# EAGLE design VM-MCU_v5.3 (EAGLE 9.6.2)

## Sheet 1 of 2: MAINBOARD UNIT
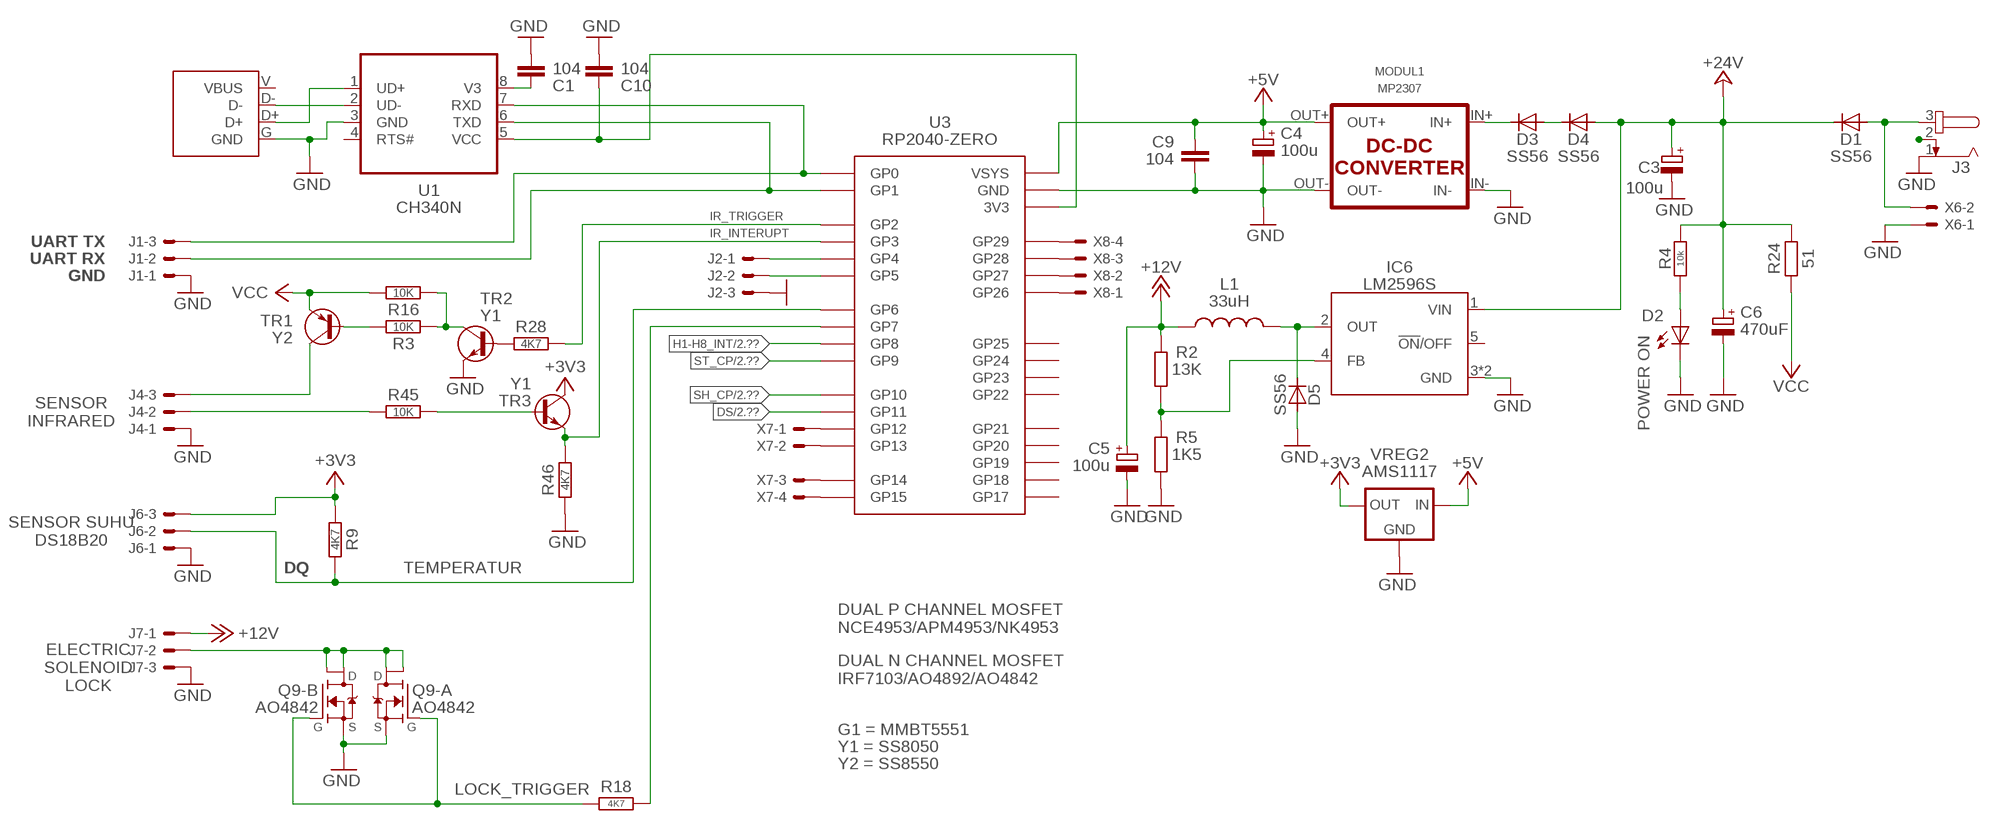
[diagram p0: schematic, sheet 1]

### Parts
C1  104  CAP_SMD-C1206  [C1206]
C3  100u  ELCO_UD-6,3X7,7  [UD-6,3X7,7_NICHICON]
C4  100u  ELCO_UD-6,3X7,7  [UD-6,3X7,7_NICHICON]
C5  100u  ELCO_UD-6,3X7,7  [UD-6,3X7,7_NICHICON]
C6  470uF  ELCO_E5-10.5  [E5-10,5]
C9  104  CAP_SMD-C1206  [C1206]
C10  104  CAP_SMD-C1206  [C1206]
D1  SS56  DIODE_DO214AC  [DO214AC]
D2  POWER ON  LED2835  [LED2835]
D3  SS56  DIODE_DO214AC  [DO214AC]
D4  SS56  DIODE_DO214AC  [DO214AC]
D5  SS56  DIODE_DO214AC  [DO214AC]
IC6  LM2596S  [TO263-5]
J1  SOKET-3P_KF2510-2.54  [KF2510-3P]
J2  SOKET-3P_JST-XH-2.54  [3P-JST-XH]
J3  JACK-DC_5.5X2.1MM  [DC-5.5X2.1]
J4  SOKET-3P_MOLEX-3.96  [3P-MOLEX]
J6  SOKET-3P_KF2510-2.54  [KF2510-3P]
J7  SOKET-3P_KF2510-2.54  [KF2510-3P]
L1  33uH  INDUKTOR10X10  [CDRH104]
MODUL1  MP2307  MINI360-MP2307MP2307-PTH  [MP2307]
Q9  AO4842  DUALFET-N_AO4892N+N  [SO-8]
R2  13K  RESISTOR_1206  [R1206]
R3  10K  RESISTOR_1206  [R1206]
R4  10k  RESISTOR_1206  [R1206]
R5  1K5  RESISTOR_1206  [R1206]
R9  4K7  RESISTOR_1206  [R1206]
R16  10K  RESISTOR_1206  [R1206]
R18  4K7  RESISTOR_1206  [R1206]
R24  51  RESISTOR_2512  [R2512]
R28  4K7  RESISTOR_1206  [R1206]
R45  10K  RESISTOR_1206  [R1206]
R46  4K7  RESISTOR_1206  [R1206]
TR1  Y2  BJT-PNP_SOT23-BCE  [SOT23-BEC]
TR2  Y1  BJT-NPN_SOT23-BEC  [SOT23-BEC]
TR3  Y1  BJT-NPN_SOT23-BEC  [SOT23-BEC]
U1  CH340N  [SO-8]
U3  RP2040-ZERO  RASPBERRY-PICO-ZERO_  [PICO-ZERO]
U$3  USB-C_BREAKOUT_  [USB-C_4P]
VREG2  AMS1117  78XXX_SOT223  [SOT223]
X6  SOKET-2P_MOLEX-3.96  [2P-MOLEX]
X7  SOKET-4P_JST-XH-2.54  [4P-JST-XH]
X8  SOKET-4P_JST-XH-2.54  [4P-JST-XH]

### Nets
+3V3: J6.3 R9.1 TR3.C VREG2.4(OUT) ; also sheet 2
+5V: C4.+ C9.1 MODUL1.OUT+ U3.5V(VSYS) VREG2.3(IN) ; also sheet 2
+12V: C5.+ J7.1 L1.1 R2.1
+24V: C3.+ C6.+ D1.C D4.A IC6.1(VIN) R4.2 R24.2 ; also sheet 2
DS: U3.P11(GP11) ; also sheet 2
GND: C1.2 C3.- C4.- C5.- C6.- C9.2 C10.2 D2.C D5.A IC6.3(GND) IC6.6(GND) J1.1 J2.3 J3.1 J4.1 J6.1 J7.3 MODUL1.IN- MODUL1.OUT- Q9.1(-A:S) Q9.3(-B:S) R5.2 R46.1 TR2.E U1.3(GND) U3.G(GND) U$3.G(GND) VREG2.1(GND) X6.1 ; also sheet 2
H1-H8_INT: U3.P8(GP8) ; also sheet 2
N$1: J1.3 U1.7(RXD) U3.P0(GP0)
N$2: J1.2 U1.6(TXD) U3.P1(GP1)
N$3: D1.A J3.3 X6.2
N$4: D2.A R4.1
N$5: J2.1 U3.P4(GP4)
N$6: R3.2 R16.2 TR2.C
N$7: R3.1 TR1.B
N$8: J2.2 U3.P5(GP5)
N$11: C10.1 U1.5(VCC) U3.3V3
N$23: J4.3 TR1.C
N$33: Q9.2(-A:G) Q9.4(-B:G) R18.2
N$34: C1.1 U1.8(V3)
N$36: U1.2(UD-) U$3.D-
N$43: J3.2
N$45: U1.1(UD+) U$3.D+
N$60: J7.2 Q9.5(-B:D1) Q9.6(-B:D2) Q9.7(-A:D2) Q9.8(-A:D1)
N$61: D3.C MODUL1.IN+
N$62: D3.A D4.C
N$64: U3.P12(GP12) X7.1
N$65: U3.P13(GP13) X7.2
N$66: U3.P14(GP14) X7.3
N$67: U3.P15(GP15) X7.4
N$68: D5.C IC6.2(OUT) L1.2
N$69: U3.P26(GP26) X8.1
N$70: U3.P27(GP27) X8.2
N$71: IC6.4(FB) R2.2 R5.1
N$72: U3.P28(GP28) X8.3
N$73: R28.1 TR2.B
N$74: R45.1 TR3.B
N$75: U3.P29(GP29) X8.4
N$86: J4.2 R45.2
P2: R28.2 U3.P2(GP2)
P3: R46.2 TR3.E U3.P3(GP3)
P6: J6.2 R9.2 U3.P6(GP6)
P7: R18.1 U3.P7(GP7)
SH_CP: U3.P10(GP10) ; also sheet 2
ST_CP: U3.P9(GP9) ; also sheet 2
VCC: R16.1 R24.1 TR1.E
Unconnected: IC6.5(!ON!/OFF) U1.4(RTS#) U3.P17(GP17) U3.P18(GP18) U3.P19(GP19) U3.P20(GP20) U3.P21(GP21) U3.P22(GP22) U3.P23(GP23) U3.P24(GP24) U3.P25(GP25) U$3.V(VBUS)

### Notes on the sheet
- IR_TRIGGER
- IR_INTERUPT
- UART TX
- UART RX
- GND
- SENSOR
  INFRARED
- SENSOR SUHU
  DS18B20
- DQ | TEMPERATUR
- DUAL P CHANNEL MOSFET
  NCE4953/APM4953/NK4953
- ELECTRIC
  SOLENOID
  LOCK
- DUAL N CHANNEL MOSFET
  IRF7103/AO4892/AO4842
- G1 = MMBT5551
- Y1 = SS8050
- Y2 = SS8550
- LOCK_TRIGGER

## Sheet 2 of 2: SHIFT REGISTER & MOSFET DRIVER
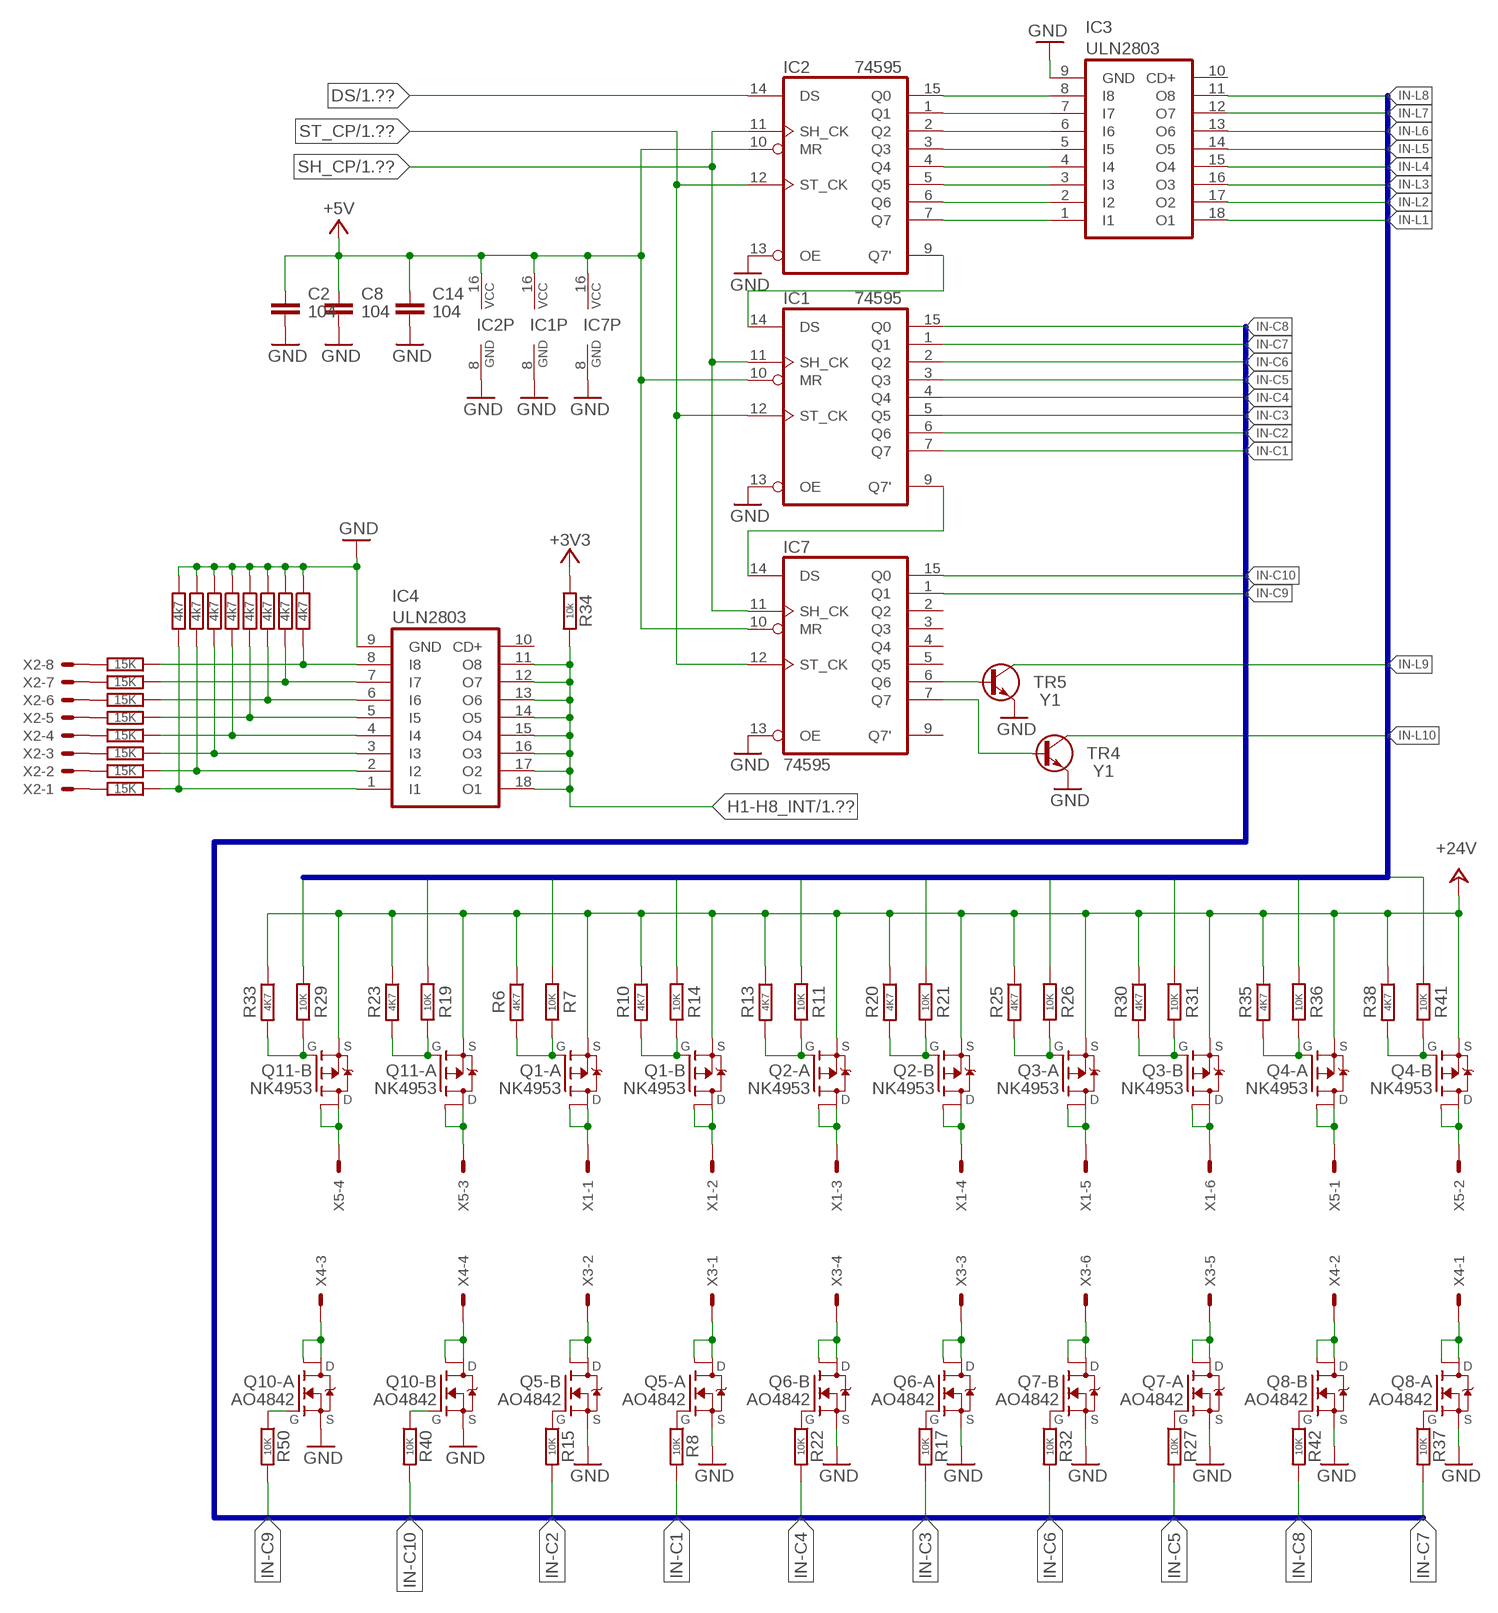
[diagram p1: schematic, sheet 2]

### Parts
C2  104  CAP_SMD-C1206  [C1206]
C8  104  CAP_SMD-C1206  [C1206]
C14  104  CAP_SMD-C1206  [C1206]
IC1  74595  [SO16]
IC2  74595  [SO16]
IC3  ULN2803  ULN2805ASO18  [SO18W]
IC4  ULN2803  ULN2805ASO18  [SO18W]
IC7  74595  [SO16]
Q1  NK4953  DUALFET-P_NCE4953P+P  [SO-8]
Q2  NK4953  DUALFET-P_NCE4953P+P  [SO-8]
Q3  NK4953  DUALFET-P_NCE4953P+P  [SO-8]
Q4  NK4953  DUALFET-P_NCE4953P+P  [SO-8]
Q5  AO4842  DUALFET-N_AO4892N+N  [SO-8]
Q6  AO4842  DUALFET-N_AO4892N+N  [SO-8]
Q7  AO4842  DUALFET-N_AO4892N+N  [SO-8]
Q8  AO4842  DUALFET-N_AO4892N+N  [SO-8]
Q10  AO4842  DUALFET-N_AO4892N+N  [SO-8]
Q11  NK4953  DUALFET-P_NCE4953P+P  [SO-8]
R1  15K  RESISTOR_0805  [R0805]
R6  4K7  RESISTOR_1206  [R1206]
R7  10K  RESISTOR_1206  [R1206]
R8  10K  RESISTOR_1206  [R1206]
R10  4K7  RESISTOR_1206  [R1206]
R11  10K  RESISTOR_1206  [R1206]
R12  15K  RESISTOR_0805  [R0805]
R13  4K7  RESISTOR_1206  [R1206]
R14  10K  RESISTOR_1206  [R1206]
R15  10K  RESISTOR_1206  [R1206]
R17  10K  RESISTOR_1206  [R1206]
R19  10K  RESISTOR_1206  [R1206]
R20  4K7  RESISTOR_1206  [R1206]
R21  10K  RESISTOR_1206  [R1206]
R22  10K  RESISTOR_1206  [R1206]
R23  4K7  RESISTOR_1206  [R1206]
R25  4K7  RESISTOR_1206  [R1206]
R26  10K  RESISTOR_1206  [R1206]
R27  10K  RESISTOR_1206  [R1206]
R29  10K  RESISTOR_1206  [R1206]
R30  4K7  RESISTOR_1206  [R1206]
R31  10K  RESISTOR_1206  [R1206]
R32  10K  RESISTOR_1206  [R1206]
R33  4K7  RESISTOR_1206  [R1206]
R34  10k  RESISTOR_1206  [R1206]
R35  4K7  RESISTOR_1206  [R1206]
R36  10K  RESISTOR_1206  [R1206]
R37  10K  RESISTOR_1206  [R1206]
R38  4K7  RESISTOR_1206  [R1206]
R39  15K  RESISTOR_0805  [R0805]
R40  10K  RESISTOR_1206  [R1206]
R41  10K  RESISTOR_1206  [R1206]
R42  10K  RESISTOR_1206  [R1206]
R43  15K  RESISTOR_0805  [R0805]
R44  15K  RESISTOR_0805  [R0805]
R47  15K  RESISTOR_0805  [R0805]
R48  15K  RESISTOR_0805  [R0805]
R49  15K  RESISTOR_0805  [R0805]
R50  10K  RESISTOR_1206  [R1206]
R51  4k7  RESISTOR_0805  [R0805]
R52  4k7  RESISTOR_0805  [R0805]
R53  4k7  RESISTOR_0805  [R0805]
R54  4k7  RESISTOR_0805  [R0805]
R55  4k7  RESISTOR_0805  [R0805]
R56  4k7  RESISTOR_0805  [R0805]
R57  4k7  RESISTOR_0805  [R0805]
R58  4k7  RESISTOR_0805  [R0805]
TR4  Y1  BJT-NPN_SOT23-BEC  [SOT23-BEC]
TR5  Y1  BJT-NPN_SOT23-BEC  [SOT23-BEC]
X1  SOKET-6P_MOLEX-3.96  [6P-MOLEX]
X2  SOKET-8P_MOLEX-3.96  [8P-MOLEX]
X3  SOKET-6P_MOLEX-3.96  [6P-MOLEX]
X4  SOKET-4P_MOLEX-3.96  [4P-MOLEX]
X5  SOKET-4P_MOLEX-3.96  [4P-MOLEX]

### Nets
+3V3: R34.2 ; also sheet 1
+5V: C2.1 C8.1 C14.1 IC1.10(MR) IC1.16(VCC) IC2.10(MR) IC2.16(VCC) IC7.10(MR) IC7.16(VCC) ; also sheet 1
+24V: Q1.1(-A:S) Q1.3(-B:S) Q2.1(-A:S) Q2.3(-B:S) Q3.1(-A:S) Q3.3(-B:S) Q4.1(-A:S) Q4.3(-B:S) Q11.1(-A:S) Q11.3(-B:S) R6.1 R10.1 R13.1 R20.1 R23.1 R25.1 R30.1 R33.1 R35.1 R38.1 ; also sheet 1
C1: Q5.5(-B:D1) Q5.6(-B:D2) X3.2
C2: Q5.7(-A:D2) Q5.8(-A:D1) X3.1
C3: Q6.5(-B:D1) Q6.6(-B:D2) X3.4
C4: Q6.7(-A:D2) Q6.8(-A:D1) X3.3
C5: Q7.5(-B:D1) Q7.6(-B:D2) X3.6
C6: Q7.7(-A:D2) Q7.8(-A:D1) X3.5
C7: Q8.5(-B:D1) Q8.6(-B:D2) X4.2
C8: Q8.7(-A:D2) Q8.8(-A:D1) X4.1
DS: IC2.14(DS) ; also sheet 1
GND: C2.2 C8.2 C14.2 IC1.8(GND) IC1.13(OE) IC2.8(GND) IC2.13(OE) IC3.9(GND) IC4.9(GND) IC7.8(GND) IC7.13(OE) Q5.1(-A:S) Q5.3(-B:S) Q6.1(-A:S) Q6.3(-B:S) Q7.1(-A:S) Q7.3(-B:S) Q8.1(-A:S) Q8.3(-B:S) Q10.1(-A:S) Q10.3(-B:S) R51.1 R52.1 R53.1 R54.1 R55.1 R56.1 R57.1 R58.1 TR4.E TR5.E ; also sheet 1
H1-H8_INT: IC4.11(O8) IC4.12(O7) IC4.13(O6) IC4.14(O5) IC4.15(O4) IC4.16(O3) IC4.17(O2) IC4.18(O1) R34.1 ; also sheet 1
I1: IC4.6(I6) R39.1 R53.2
I2: IC4.5(I5) R43.1 R54.2
I3: IC4.4(I4) R44.1 R55.2
I4: IC4.3(I3) R47.1 R56.2
I5: IC4.2(I2) R48.1 R57.2
I6: IC4.1(I1) R49.1 R58.2
IN-C1: IC1.7(Q7) R8.2
IN-C2: IC1.6(Q6) R15.2
IN-C3: IC1.5(Q5) R17.2
IN-C4: IC1.4(Q4) R22.2
IN-C5: IC1.3(Q3) R27.2
IN-C6: IC1.2(Q2) R32.2
IN-C7: IC1.1(Q1) R37.2
IN-C8: IC1.15(Q0) R42.2
IN-C9: IC7.1(Q1) R50.2
IN-C10: IC7.15(Q0) R40.2
IN-L1: IC3.18(O1) R7.2
IN-L2: IC3.17(O2) R14.2
IN-L3: IC3.16(O3) R11.2
IN-L4: IC3.15(O4) R21.2
IN-L5: IC3.14(O5) R26.2
IN-L6: IC3.13(O6) R31.2
IN-L7: IC3.12(O7) R36.2
IN-L8: IC3.11(O8) R41.2
IN-L9: R19.2 TR5.C
IN-L10: R29.2 TR4.C
L1: Q1.7(-A:D2) Q1.8(-A:D1) X1.1
L2: Q1.5(-B:D1) Q1.6(-B:D2) X1.2
L3: Q2.7(-A:D2) Q2.8(-A:D1) X1.3
L4: Q2.5(-B:D1) Q2.6(-B:D2) X1.4
L5: Q3.7(-A:D2) Q3.8(-A:D1) X1.5
L6: Q3.5(-B:D1) Q3.6(-B:D2) X1.6
L7: Q4.7(-A:D2) Q4.8(-A:D1) X5.1
L8: Q4.5(-B:D1) Q4.6(-B:D2) X5.2
N$9: IC4.8(I8) R12.1 R51.2
N$10: IC4.7(I7) R1.1 R52.2
N$12: IC2.15(Q0) IC3.8(I8)
N$13: R43.2 X2.5
N$14: R44.2 X2.4
N$15: IC2.1(Q1) IC3.7(I7)
N$16: Q1.2(-A:G) R6.2 R7.1
N$17: R47.2 X2.3
N$18: Q5.2(-A:G) R8.1
N$19: Q5.4(-B:G) R15.1
N$20: Q1.4(-B:G) R10.2 R14.1
N$21: IC2.2(Q2) IC3.6(I6)
N$22: Q2.2(-A:G) R11.1 R13.2
N$24: R39.2 X2.6
N$25: R48.2 X2.2
N$26: IC2.3(Q3) IC3.5(I5)
N$27: Q6.2(-A:G) R17.1
N$28: R1.2 X2.7
N$29: IC2.4(Q4) IC3.4(I4)
N$30: R49.2 X2.1
N$31: Q6.4(-B:G) R22.1
N$32: Q2.4(-B:G) R20.2 R21.1
N$35: Q7.2(-A:G) R27.1
N$37: IC2.5(Q5) IC3.3(I3)
N$38: IC2.6(Q6) IC3.2(I2)
N$39: IC2.7(Q7) IC3.1(I1)
N$40: Q7.4(-B:G) R32.1
N$41: Q8.2(-A:G) R37.1
N$42: Q3.2(-A:G) R25.2 R26.1
N$44: Q8.4(-B:G) R42.1
N$46: R12.2 X2.8
N$47: IC1.9(Q7') IC7.14(DS)
N$48: Q10.4(-B:G) R40.1
N$49: Q3.4(-B:G) R30.2 R31.1
N$50: Q11.4(-B:G) R29.1 R33.2
N$51: Q10.2(-A:G) R50.1
N$52: Q11.2(-A:G) R19.1 R23.2
N$53: IC7.7(Q7) TR4.B
N$54: IC7.6(Q6) TR5.B
N$55: Q11.7(-A:D2) Q11.8(-A:D1) X5.3
N$56: Q4.2(-A:G) R35.2 R36.1
N$57: Q11.5(-B:D1) Q11.6(-B:D2) X5.4
N$58: Q10.7(-A:D2) Q10.8(-A:D1) X4.3
N$59: Q10.5(-B:D1) Q10.6(-B:D2) X4.4
N$63: Q4.4(-B:G) R38.2 R41.1
N$84: IC1.14(DS) IC2.9(Q7')
SH_CP: IC1.11(SH_CK) IC2.11(SH_CK) IC7.11(SH_CK) ; also sheet 1
ST_CP: IC1.12(ST_CK) IC2.12(ST_CK) IC7.12(ST_CK) ; also sheet 1
Unconnected: IC3.10(CD+) IC4.10(CD+) IC7.2(Q2) IC7.3(Q3) IC7.4(Q4) IC7.5(Q5) IC7.9(Q7')

### Buses
IN-L1,IN-L2,IN-L3,IN-L4,IN-L5,IN-L6,IN-L7,IN-L8,IN-L9,IN-L10,L1..L10-BUS
IN-C1,IN-C2,IN-C3,IN-C4,IN-C5,IN-C6,IN-C7,IN-C8,IN-C9,IN-C10

## Library data of the parts
C1 C2 C8-C10 C14 = MyFavorite:CAP_: CAPACITOR, European symbol
C3-C6 = MyFavorite:ELCO_: POLARIZED CAPACITOR, European symbol; SPICEPREFIX: C
D1 D3-D5 = MyFavorite:DIODE_
D2 = MyFavorite:LED
IC1 IC2 IC7 = VM-MCU:74*595: 8-bit SHIFT REGISTER, output latch
IC3 IC4 = VM-MCU:ULN2805A: DRIVER ARRAY
IC6 = VM-MCU:LM2596: SIMPLE SWITCHER® Power Converter 150 kHz 3A Step-Down Voltage Regulator Source: http://www.national.com/ds/LM/LM2596.pdf; MF: NATIONAL SEMICONDUCTOR; MPN: LM2596S-ADJ/NOPB; OC_FARNELL: 9494367; OC_NEWARK: 41K3842
J1 J2 J6 J7 = MYConnector:SOKET-3P_: KK 156 HEADER Source: http://www.molex.com/pdm_docs/sd/026604100_sd.pdf
J3 = MyFavorite:JACK-DC_: DC POWER JACK Power Jack, DC, Right Angle, Through Hole, Rated 5A at 16VDC, PC Terminals Distributor: Farnell (www.Farnell.de) Drawing: 84N1161.pdf / 84N1162.pdf Manufacturer: SPC Technology (www.spctechnology.com) Type: SPC4077 / SPC 4078; OC_FARNELL: unknown; OC_NEWARK: unknown
J4 = MYConnector:SOKET-3P_: KK 156 HEADER Source: http://www.molex.com/pdm_docs/sd/026604100_sd.pdf; MF: MOLEX; OC_FARNELL: unknown; OC_NEWARK: unknown
L1 = MyFavorite:INDUKTOR
MODUL1 = DC-MODUL:MINI360-MP2307
Q1-Q4 Q11 = VM-MCU:DUALFET-P_
Q5-Q10 = VM-MCU:DUALFET-N_
R1 R4 R6-R8 R10-R15 R17 R19-R27 R29-R45 R47-R58 = MyFavorite:RESISTOR_: RESISTOR, European symbol
R2 R3 R5 R9 R16 R18 R28 R46 = VM-MCU:RESISTOR_: RESISTOR, European symbol
TR1 = VM-MCU:BJT-PNP_: PNP Transistror
TR2-TR5 = VM-MCU:BJT-NPN_: NPN Transistror BF959 corrected 2008.03.06
U1 = VM-MCU:CH340N
U3 = VM-MCU:RASPBERRY-PICO-ZERO_
U$3 = VM-MCU:USB-C_BREAKOUT_
VREG2 = VM-MCU:78XXX_: VOLTAGE REGULATOR
X1 X3 = MYConnector:SOKET-6P_: KK 156 HEADER Source: http://www.molex.com/pdm_docs/sd/026604100_sd.pdf; MF: MOLEX; OC_FARNELL: unknown; OC_NEWARK: unknown
X2 = MYConnector:SOKET-8P_: KK 156 HEADER Source: http://www.molex.com/pdm_docs/sd/026604100_sd.pdf; MF: MOLEX; OC_FARNELL: unknown; OC_NEWARK: unknown
X4 X5 = MYConnector:SOKET-4P_: KK 156 HEADER Source: http://www.molex.com/pdm_docs/sd/026604100_sd.pdf; MF: MOLEX; OC_FARNELL: unknown; OC_NEWARK: unknown
X6 = MYConnector:SOKET-2P_: KK 156 HEADER Source: http://www.molex.com/pdm_docs/sd/026604100_sd.pdf; MF: MOLEX; OC_FARNELL: unknown; OC_NEWARK: unknown
X7 X8 = MYConnector:SOKET-4P_: KK 156 HEADER Source: http://www.molex.com/pdm_docs/sd/026604100_sd.pdf

## Board
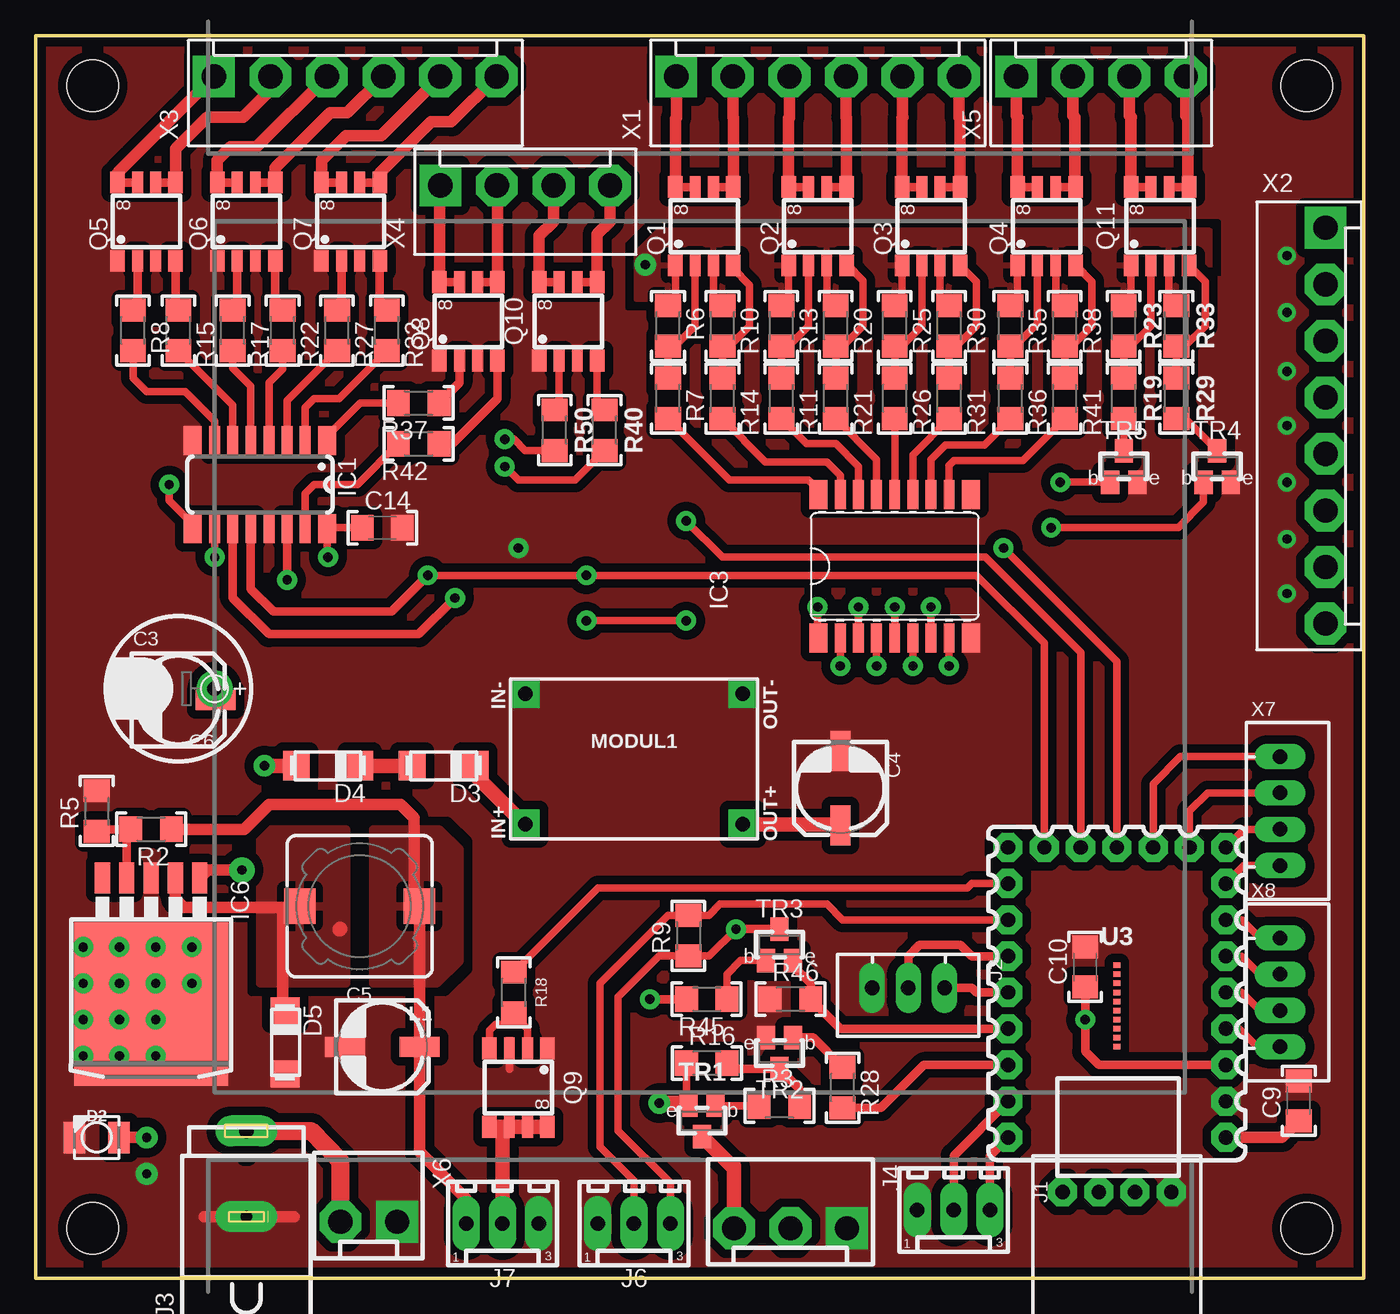
[diagram p2: board, top side]
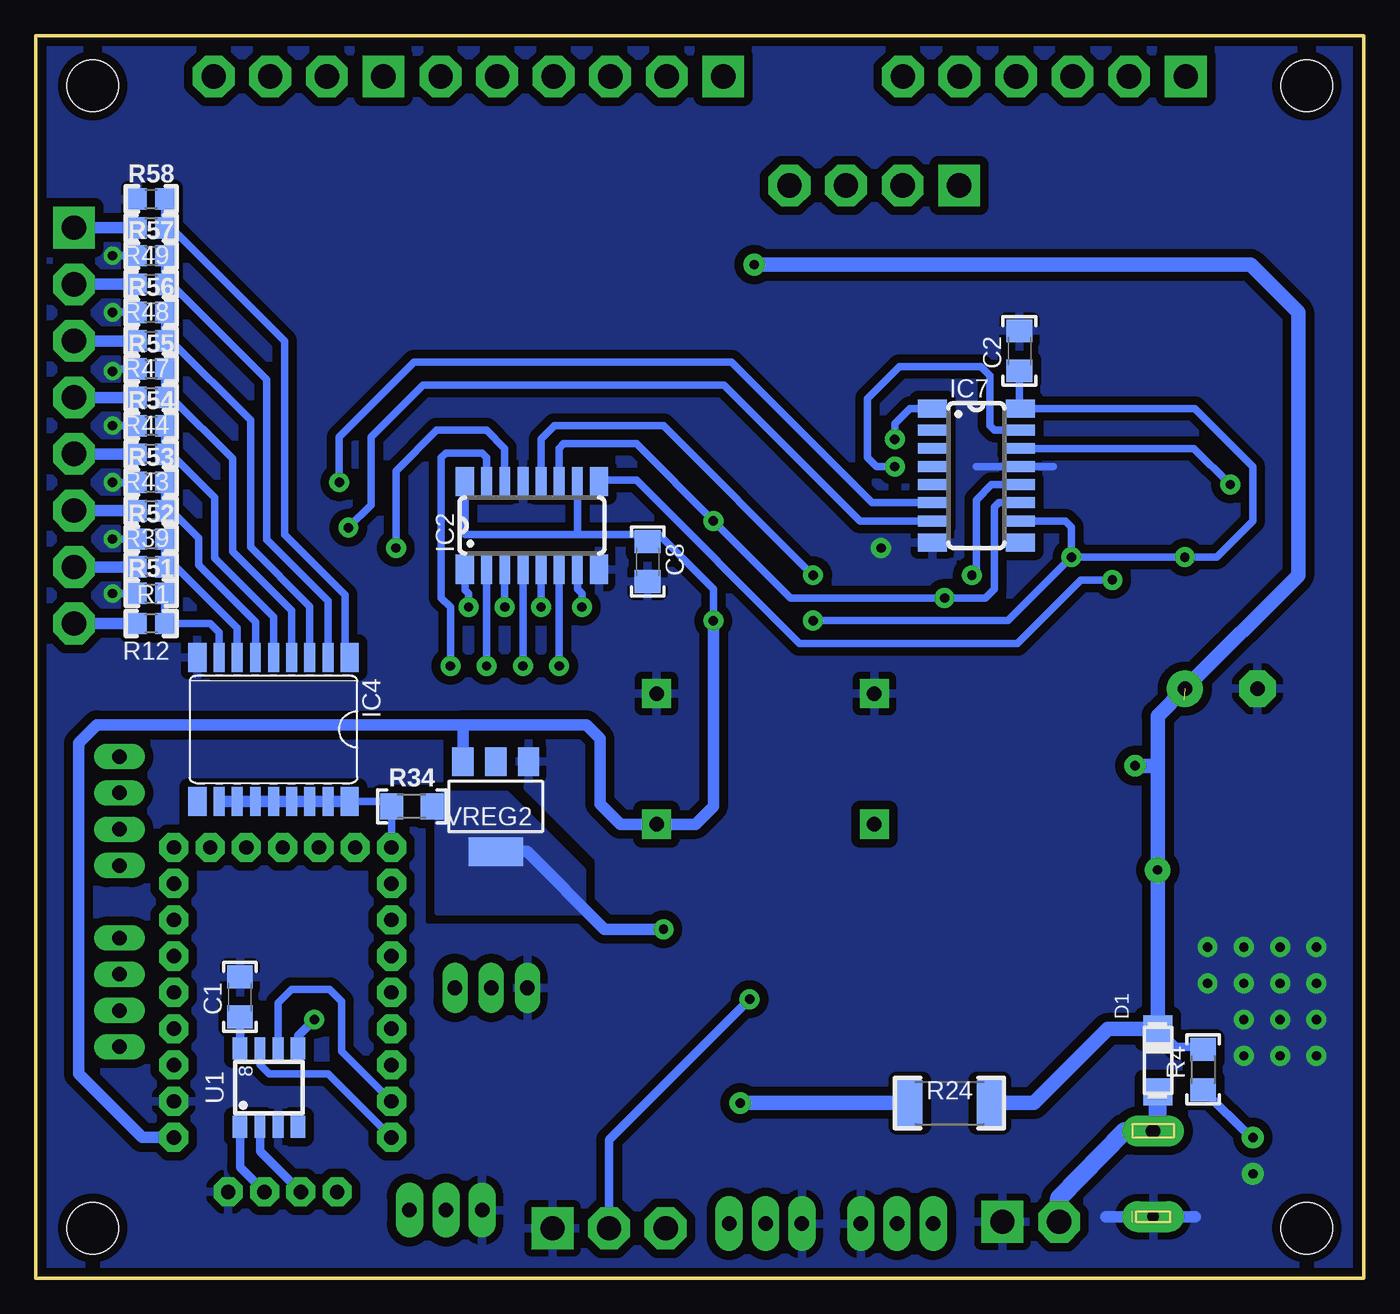
[diagram p3: board, bottom side, seen from below]

Size 93 x 87 mm. Coordinates in mm from the lower left corner, seen from the top.
Copper layers (1*16): Top 0.035mm / dielectric 1.5mm / Bottom 0.035mm
Design rules "default *": minimum track width 6mil, minimum drill 0.35mm, track to track 24mil, track to pad 6mil, pad to pad 0mil, via to via 6mil, smd to smd 0mil, copper to edge 24mil, drill to drill 6mil, minimum pad ring 10mil, minimum via ring 8mil, stop-mask expansion 4mil, vias tented up to drill 0mil, thermal gap 20mil

### Footprints (pad centres in the part's own frame; a part is rotated, then mirrored left to right if it is on the bottom)
C1206 = smd 1.6 x 1.8: 1 -1.4,0; 2 1.4,0
UD-6,3X7,7_NICHICON = smd 2.8 x 1.397: + 2.604,0; - -2.604,0
E5-10,5 = drill 1.016 pad 2.54: + -2.54,0 | drill 1.016 pad 2.54 octagon: - 2.54,0
DO214AC = smd 1.88 x 2.032: A 2.21,0; C -2.21,0
LED2835 = smd 1.5 x 2.2: A -1.55,0; C 1.55,0
SO16 = smd 1.27 x 2.032: 1 -4.699,-3.073; 8 4.699,-3.073; 9 4.699,3.073; 16 -4.699,3.073 | smd 0.762 x 2.032: 2 -3.175,-3.073; 3 -1.905,-3.073; 4 -0.635,-3.073; 5 0.635,-3.073; 6 1.905,-3.073; 7 3.175,-3.073; 10 3.175,3.073; 11 1.905,3.073; 12 0.635,3.073; 13 -0.635,3.073; 14 -1.905,3.073; 15 -3.175,3.073
SO18W = smd 1.27 x 2.032: 1 -5.334,-5.029; 9 5.334,-5.029; 10 5.334,5.029; 18 -5.334,5.029 | smd 0.762 x 2.032: 2 -3.81,-5.029; 3 -2.54,-5.029; 4 -1.27,-5.029; 5 0,-5.029; 6 1.27,-5.029; 7 2.54,-5.029; 8 3.81,-5.029; 11 3.81,5.029; 12 2.54,5.029; 13 1.27,5.029; 14 0,5.029; 15 -1.27,5.029; 16 -2.54,5.029; 17 -3.81,5.029
TO263-5 = smd 1.067 x 2.159: 1 -3.404,-5.791; 2 -1.702,-5.791; 3 0,-5.791; 4 1.702,-5.791; 5 3.404,-5.791 | smd 10.8 x 11.43: 6 0,3.048
KF2510-3P = drill 1.016 pad 1.93 long: 1 2.54,0; 2 0,0; 3 -2.54,0
3P-JST-XH = drill 1.016 pad 1.778 long: 1 -2.54,0; 2 0,0; 3 2.54,0
DC-5.5X2.1 = drill 0.8 pad 2.184 long: 1 -3,0 | smd 0.254 x 0.254: 2 1.27,0 | drill 1 pad 2.184 long: 3 3,0
3P-MOLEX = drill 1.7 pad 2.921 square: 1 -3.96,0 | drill 1.7 pad 2.921 octagon: 2 0,0; 3 3.96,0
CDRH104 = smd 2.2 x 2.5: 1 -4.191,0; 2 4.191,0
MP2307 = drill 1 pad 2.032 square: IN+ -7.62,-4.572; IN- -7.62,4.572; OUT+ 7.62,-4.572; OUT- 7.62,4.572
SO-8 = smd 1.524 x 1.016: 1 -2.743,2.032; 4 -2.743,-2.032; 5 2.743,-2.032; 8 2.743,2.032 | smd 1.524 x 0.762: 2 -2.743,0.635; 3 -2.743,-0.635; 6 2.743,-0.635; 7 2.743,0.635
R0805 = smd 1.3 x 1.5: 1 -0.95,0; 2 0.95,0
R1206 = smd 1.6 x 1.803: 1 -1.422,0; 2 1.422,0
R2512 = smd 1.8 x 3.2: 1 -2.8,0; 2 2.8,0
SOT23-BEC = smd 1.27 x 1.651: B -0.95,-1.1; C 0,1.1; E 0.95,-1.1
PICO-ZERO = drill 1 pad 2.032 octagon: 3V3 0,-5.08; 5V 0,0; G 0,-2.54; P0 15.24,0; P1 15.24,-2.54; P2 15.24,-5.08; P3 15.24,-7.62; P4 15.24,-10.16; P5 15.24,-12.7; P6 15.24,-15.24; P7 15.24,-17.78; P8 15.24,-20.32; P9 12.7,-20.32; P10 10.16,-20.32; P11 7.62,-20.32; P12 5.08,-20.32; P13 2.54,-20.32; P14 0,-20.32; P15 0,-17.78; P26 0,-15.24; P27 0,-12.7; P28 0,-10.16; P29 0,-7.62 | smd 0.508 x 0.381: GND2 7.62,-6.35; P17 7.62,-12.065; P18 7.62,-11.43; P19 7.62,-10.795; P20 7.62,-10.16; P21 7.62,-9.525; P22 7.62,-8.89; P23 7.62,-8.255; P24 7.62,-7.62; P25 7.62,-6.985
BOX-PLC_115X90_V2 = hole 3.6: -42.5,40; 42.5,40; -42.5,-40; 42.5,-40
USB-C_4P = drill 1 pad 2.032 octagon: D+ 0,-5.08; D- 0,-2.54; G 0,-7.62; V 0,0
SOT223 = smd 1.5 x 2: 1 -2.3,-3.15; 2 0,-3.15; 3 2.3,-3.15 | smd 3.8 x 2: 4 0,3.15
6P-MOLEX = drill 1.7 pad 2.921 square: 1 -9.9,0 | drill 1.7 pad 2.921 octagon: 2 -5.94,0; 3 -1.98,0; 4 1.98,0; 5 5.94,0; 6 9.9,0
8P-MOLEX = drill 1.7 pad 2.921 square: 1 -13.86,0 | drill 1.7 pad 2.921 octagon: 2 -9.9,0; 3 -5.94,0; 4 -1.98,0; 5 1.98,0; 6 5.94,0; 7 9.9,0; 8 13.86,0
4P-MOLEX = drill 1.7 pad 2.921 square: 1 -5.94,0 | drill 1.7 pad 2.921 octagon: 2 -1.98,0; 3 1.98,0; 4 5.94,0
2P-MOLEX = drill 1.7 pad 2.921 square: 1 -1.98,0 | drill 1.7 pad 2.921 octagon: 2 1.98,0
4P-JST-XH = drill 1.016 pad 1.778 long: 1 -3.81,0; 2 -1.27,0; 3 1.27,0; 4 3.81,0

### Placement (x,y rotation side)
C1  78.69,19.69 90 bottom
C2  24.12,64.93 90 bottom
C3  9.99,40.48 0 top
C4  56.34,34.29 270 top
C5  24.27,16.2 0 top
C6  9.99,41.28 180 top
C8  50.15,50.17 270 bottom
C9  88.44,12.42 90 top
C10  73.49,21.78 90 top
C14  24.27,52.55 0 top
D1  14.43,15.24 270 bottom
D2  4.27,9.84 180 top
D3  28.56,35.88 180 top
D4  20.46,35.88 180 top
D5  17.47,16.51 270 top
IC1  15.7,55.56 180 top
IC2  58.25,52.71 0 bottom
IC3  60.15,49.85 0 top
IC4  76.34,38.42 180 bottom
IC6  8.08,22.23 180 top
IC7  27.13,56.2 270 bottom
J1  64.28,4.77 180 top
J2  61.11,20.32 180 top
J3  14.75,7.3 90 top
J4  52.85,3.49 180 top
J6  41.9,3.81 180 top
J7  32.69,3.81 180 top
L1  22.69,26.04 180 top
MODUL1  41.9,36.36 0 top
Q1  46.82,73.66 90 top
Q2  54.76,73.66 90 top
Q3  62.69,73.66 90 top
Q4  70.79,73.66 90 top
Q5  7.77,73.98 90 top
Q6  14.75,73.98 90 top
Q7  22.05,73.98 90 top
Q8  30.31,67 90 top
Q9  33.8,13.34 270 top
Q10  37.29,67 90 top
Q11  78.73,73.66 90 top
R1  84.92,49.8 180 bottom
R2  8.08,31.44 180 top
R3  52.08,12.07 0 top
R4  11.26,14.61 90 bottom
R5  4.27,32.7 90 top
R6  44.28,66.68 270 top
R7  44.28,61.6 270 top
R8  6.81,66.36 270 top
R9  45.71,23.97 90 top
R10  48.09,66.68 270 top
R11  52.22,61.6 270 top
R12  84.92,45.84 180 bottom
R13  52.22,66.68 270 top
R14  48.09,61.6 270 top
R15  9.99,66.36 270 top
R16  47,15.05 0 top
R17  13.8,66.36 270 top
R18  33.48,20 270 top
R19  76.19,61.6 270 top
R20  56.02,66.68 270 top
R21  56.02,61.6 270 top
R22  17.29,66.36 270 top
R23  76.19,66.68 270 top
R24  29.01,12.26 0 bottom
R25  60.15,66.68 270 top
R26  60.15,61.6 270 top
R27  21.1,66.36 270 top
R28  56.5,13.34 270 top
R29  79.87,61.6 270 top
R30  63.96,66.68 270 top
R31  63.96,61.6 270 top
R32  24.59,66.36 270 top
R33  79.87,66.68 270 top
R34  66.66,33.02 0 bottom
R35  68.25,66.68 270 top
R36  68.25,61.6 270 top
R37  26.82,61.28 180 top
R38  72.06,66.68 270 top
R39  84.92,53.74 180 bottom
R40  39.83,59.38 270 top
R41  72.06,61.6 270 top
R42  26.82,58.42 180 top
R43  84.92,57.7 180 bottom
R44  84.92,61.66 180 bottom
R45  46.98,19.53 180 top
R46  52.85,19.53 0 top
R47  84.92,65.62 180 bottom
R48  84.92,69.59 180 bottom
R49  84.92,73.55 180 bottom
R50  36.34,59.38 270 top
R51  84.92,47.95 0 bottom
R52  84.92,51.76 0 bottom
R53  84.92,55.72 0 bottom
R54  84.92,59.69 0 bottom
R55  84.92,63.66 0 bottom
R56  84.92,67.63 0 bottom
R57  84.92,71.6 0 bottom
R58  84.92,75.57 0 bottom
TR1  46.66,11.02 180 top
TR2  52.09,15.75 180 top
TR3  52.09,23.34 0 top
TR4  82.73,56.84 0 top
TR5  76.19,56.84 0 top
U1  76.66,13.34 90 bottom
U3  83.33,9.84 180 top
U$1  [BOX-PLC_115X90_V2]  46.5,43.5 0 top
U$3  71.9,6.03 90 top
VREG2  60.79,33.02 180 bottom
X1  54.76,84.14 0 top
X2  90.31,59.69 270 top
X3  22.37,84.14 0 top
X4  34.28,76.52 0 top
X5  74.6,84.14 0 top
X6  23.32,3.94 180 top
X7  87.14,32.7 270 top
X8  87.14,20 270 top

### Tracks (layer width: path | path; a pad name or v marks a point on that pad's centre or on a via)
+3V3  (via drill 0.65 pad 1.4)
  Top 0.508: J6.3 44.44,6.66 40.78,10.32 40.78,19.69 43.64,22.55 R9.1 47.16,22.55 v49.04,24.43
  Top 0.61: TR3.C v49.05,24.44 v49.04,24.43
  Bottom 0.813: v49.04,24.43 53.17,24.43 58.61,29.87 VREG2.4
  Bottom 1.016: VREG2.4 60.47,29.55
  pour Bottom (isolate 0.61, no thermals): 64.91,33.5 64.91,25.56 54.6,25.56 54.6,28.58 59.99,33.98 64.44,33.98
+5V  (via drill 0.65 pad 1.4)
  Top 0.508: v20.46,50.48 20.4,50.55 IC1.16 20.46,52.55 C14.1 | v12.53,50.48 IC1.10 | v45.55,46.04 v38.56,46.04
  Top 0.813: C9.1 87.27,9.84 U3.5V
  Top 1.016: C4.+ 56.34,31.78 MODUL1.OUT+
  Bottom 0.508: 55.07,52.07 62.95,52.07 IC2.16 | IC2.10 55.07,52.07 | v20.46,50.48 v12.53,50.48 10.3,50.48 7.77,53.02 7.77,56.84 11.83,60.9 IC7.16 24.12,60.96 C2.1 | v20.46,50.48 20.46,52.61 20.88,53.02 IC7.10 | 55.07,52.07 49.99,52.07 | 49.99,52.07 49.36,52.07 45.55,48.26 v45.55,46.04 | v20.46,50.48 24.91,46.04 v38.56,46.04 | C8.1 50.15,51.91 49.99,52.07
  Bottom 0.813: U3.5V 85.55,9.84 90,14.29 90,37.47 88.73,38.74 63.17,38.74 | VREG2.3 63.09,38.66 63.17,38.74 | 63.17,38.74 54.44,38.74 53.48,37.78 53.48,33.21 52.06,31.78 MODUL1.OUT+ 46.79,31.78 45.55,33.02 v45.55,46.04
+12V
  Top 0.813: R2.1 14.58,31.44 16.33,33.18 25.55,33.18 26.49,32.24 26.49,26.04 26.88,25.65 C5.+ 26.88,8.83 30.15,5.56 J7.1
  pour Top (isolate 0.61): 23.64,31.44 28.24,31.44 29.67,30.01 29.67,22.23 28.09,20.64 23.64,20.64
+24V  (via drill 0.65 pad 1.52, 0.65 pad 1.78)  (1 unrouted)
  Top 0.508: Q3.1 60.66,68.61 R25.1 | Q3.3 63.33,68.73 R30.1 | Q1.3 47.45,68.27 47.62,68.1 R10.1 | Q1.1 44.79,68.61 R6.1 | Q2.3 55.39,68.58 55.71,68.27 55.86,68.27 R20.1 56.02,68.58 | Q2.1 52.72,68.61 R13.1 | Q4.3 71.42,68.73 R38.1 | Q4.1 68.76,68.61 R35.1 | Q11.1 76.69,68.61 R23.1 | Q11.3 79.36,68.61 R33.1
  Top 0.813: IC6.1 12.05,28.58 v14.43,28.58
  Top 1.016: D4.A v16.02,35.88
  Bottom 0.61: R4.2 11.26,16.18 13.16,16.18 D1.C
  Bottom 1.016: v42.69,70.96 7.92,70.96 4.59,67.63 4.59,49.22 C6.+ 14.43,39.37 v14.43,28.58 | v14.43,28.58 D1.C 17.93,17.45 23.12,12.26 R24.2 | v14.43,28.58 14.43,35.88 v16.02,35.88
  pour Top (isolate 0.61): 42.05,68.58 82.22,68.58 82.22,73.34 43.64,73.34 42.05,71.76
C1
  Top 0.61: Q5.6 Q5.5
  Top 0.813: Q5.5 9.8,79.08 12,81.28 14.52,81.28 16.43,83.19 X3.2
C2
  Top 0.61: Q5.8 Q5.7
  Top 0.813: X3.1 5.73,77.4 Q5.8
C3
  Top 0.61: Q6.6 Q6.5
  Top 0.813: Q6.5 16.78,77.77 20.62,81.6 21.81,81.6 X3.4
C4
  Top 0.61: Q6.8 Q6.7
  Top 0.813: Q6.8 12.72,78.3 13.65,79.22 15.48,79.22 X3.3
C5
  Top 0.61: Q7.6 Q7.5
  Top 0.813: Q7.5 24.08,77.36 27.69,80.97 29.09,80.97 X3.6
C6
  Top 0.61: Q7.8 Q7.7
  Top 0.813: X3.5 24.18,80.01 21.73,80.01 20.02,78.3 Q7.8
C7
  Top 0.61: Q8.6 Q8.5
  Top 0.813: X4.2 32.3,75.57 32.34,75.52 Q8.5
C8
  Top 0.61: Q8.8 Q8.7
  Top 0.813: X4.1 28.34,75.41 28.28,75.35 Q8.8
DS  (via drill 0.65 pad 1.4)
  Top 0.508: v67.77,51.12 75.71,43.18 U3.P11
  Bottom 0.508: IC2.14 60.15,58.11 61.42,59.38 64.91,59.38 67.77,56.52 v67.77,51.12
GND  (via drill 0.65 pad 1.27, 0.65 pad 1.4, 0.65 pad 1.52)
  Top 0.508: Q9.3 33.16,14.61
  Top 0.813: 18.1,4.3 J3.1 11.81,4.3
  Bottom 0.508: 21.73,56.84 IC7.13 27.13,56.84 | R57.1 87.3,71.6 87.46,71.76 v87.62,71.6 | R56.1 v87.62,67.63 | R55.1 87.62,63.66 v87.62,63.5 | R54.1 v87.62,59.69 | R53.1 v87.62,55.72 87.78,55.56 | R52.1 v87.62,51.76 | R51.1 v87.62,47.95
  Bottom 0.813: 11.81,4.3 J3.1 18.07,4.3
  other vias: 3.32,20.64 3.32,23.18 3.32,18.1 3.32,15.56 5.86,18.1 5.86,15.56 8.4,15.56 8.4,18.1 5.86,20.64 5.86,23.18 8.4,23.18 8.4,20.64 10.94,20.64 10.94,23.18 33.8,51.12 7.77,7.3
  pour Top (isolate 0.508, rank 3, no thermals): 92.22,86.68 0.78,86.68 0.78,0.32 92.22,0.32
  pour Bottom (isolate 0.508, rank 2): 92.22,86.68 0.78,86.68 0.78,0.32 92.22,0.32
H1-H8_INT
  Bottom 0.508: IC4.18 68.3,33.39 68.09,33.18 U3.P8 R34.1
  Bottom 0.813: IC4.18 IC4.17 IC4.16 IC4.15 IC4.14 IC4.13 IC4.12 IC4.11
I1
  Bottom 0.508: IC4.6 77.61,45.95 81.59,49.93 81.59,51.83 83.5,53.74 R39.1 R53.2
I2
  Bottom 0.508: IC4.5 76.34,46.31 80.46,50.42 80.46,54.66 83.5,57.7 R43.1 R54.2
I3
  Bottom 0.508: IC4.4 75.08,46.73 79.21,50.87 79.21,57.38 83.5,61.66 R44.1 R55.2
I4
  Bottom 0.508: IC4.3 73.81,47.04 77.94,51.18 77.94,60.07 83.5,65.62 R47.1 R56.2
I5
  Bottom 0.508: IC4.2 72.53,47.42 76.82,51.7 76.82,62.91 83.5,69.59 R48.1 R57.2
I6
  Bottom 0.508: IC4.1 71.33,43.77 71.33,47.85 75.56,52.08 75.56,65.61 83.5,73.55 R49.1 R58.2
IN-C1
  Top 0.508: R8.2 6.81,63.03 7.77,62.07 10.47,62.07 12.53,60.01 IC1.7
  Top 0.61: R8.2 6.81,64.77
IN-C2
  Top 0.508: R15.2 13.8,61.13 IC1.6
IN-C3
  Top 0.508: IC1.5 15.07,62.45 13.8,63.72 R17.2
IN-C4
  Top 0.508: R22.2 17.29,63.67 16.34,62.72 IC1.4
IN-C5
  Top 0.508: R27.2 17.61,61.45 IC1.3
IN-C6
  Top 0.508: R32.2 21.25,61.6 19.51,61.6 18.88,60.96 IC1.2
IN-C7
  Top 0.508: IC1.1 20.4,58.96 22.73,61.28 R37.2
IN-C8
  Top 0.508: IC1.15 18.88,54.93 19.51,55.56 22.54,55.56 R42.2
IN-C9  (via drill 0.65 pad 1.4)
  Top 0.508: R50.2 34.27,57.95 33.48,58.74 v32.85,58.74
  Bottom 0.508: IC7.1 31.79,60.9 32.85,59.84 v32.85,58.74
IN-C10  (via drill 0.65 pad 1.4)
  Top 0.508: v32.85,56.84 33.8,55.88 37.76,55.88 R40.2
  Bottom 0.508: v32.85,56.84 34.12,56.84 34.75,57.47 34.75,61.6 32.53,63.82 26.82,63.82 26.18,63.19 26.18,59.69 25.86,59.38 IC7.15
IN-L1
  Top 0.508: R7.2 48.57,55.88 54.12,55.88 54.82,55.18 IC3.18
IN-L2
  Top 0.508: R14.2 51.11,57.15 55.39,57.15 56.34,56.2 IC3.17
IN-L3
  Top 0.508: R11.2 53.97,58.42 56.02,58.42 57.61,56.84 IC3.16
IN-L4
  Top 0.508: R21.2 58.88,57.32 IC3.15
IN-L5
  Top 0.508: R26.2 IC3.14
IN-L6
  Top 0.508: R31.2 61.42,57.64 IC3.13
IN-L7
  Top 0.508: IC3.12 62.69,57.33 63.72,58.35 66.42,58.35 R36.2
IN-L8
  Top 0.508: IC3.11 63.96,56.91 64.28,57.23 69.12,57.23 R41.2
IN-L9
  Top 0.508: R19.2 TR5.C
IN-L10
  Top 0.508: 82.85,57.77 TR4.C 82.73,57.95 80.5,60.17 R29.2
L1
  Top 0.61: Q1.8 Q1.7
  Top 0.813: Q1.8 44.79,81.2 44.85,81.27 | 44.85,81.27 44.87,81.28 | X1.1 44.85,81.27
L2
  Top 0.61: Q1.6 Q1.5
  Top 0.813: Q1.5 48.85,81.27 48.81,81.3 X1.2
L3
  Top 0.61: Q2.7 Q2.8
  Top 0.813: 52.79,81.28 52.77,81.27 | Q2.8 52.72,81.21 52.77,81.27 | X1.3 52.77,81.27
L4
  Top 0.61: Q2.6 Q2.5
  Top 0.813: Q2.5 56.79,81.25 56.73,81.3 X1.4
L5
  Top 0.61: Q3.7 Q3.8
  Top 0.813: Q3.8 60.66,81.23 60.71,81.28 60.7,81.3 X1.5
L6
  Top 0.61: Q3.6 Q3.5
  Top 0.813: Q3.5 64.72,81.23 64.66,81.3 X1.6
L7
  Top 0.61: Q4.7 Q4.8
  Top 0.813: Q4.8 68.76,81.25 68.79,81.28 68.66,81.41 X5.1
L8
  Top 0.61: Q4.6 Q4.5
  Top 0.813: Q4.5 72.75,76.47 72.75,81.28 72.62,81.41 X5.2
N$1
  Top 0.61: U3.P0 66.82,8.58 J1.3
  Bottom 0.508: U3.P0 72.53,14.29 76.66,14.29 77.3,14.93 U1.7
N$2
  Top 0.61: U3.P1 64.28,8.58 J1.2
  Bottom 0.508: U1.6 76.03,19.26 75.08,20.21 72.42,20.21 71.58,19.37 71.58,15.88 U3.P1
N$3
  Top 1.27: X6.2 21.34,8.19 19.28,10.3 J3.3
  Bottom 1.27: X6.2 21.34,5.6 16.76,10.29 J3.3 14.43,10.62 D1.A
  Bottom 1.524: J3.3 14.82,10.24
N$4  (via drill 0.65 pad 1.52)
  Top 0.813: v7.77,9.84 D2.A
  Bottom 0.61: R4.1 7.92,9.84 v7.77,9.84
N$5
  Top 0.61: U3.P4 65.87,20 65.55,20.32 J2.1
N$6
  Top 0.61: R3.2 53.5,13.24 TR2.C 48.92,14.65 R16.2
N$7
  Top 0.508: R3.1 47.66,12.07 TR1.B 47.77,11.96 47.77,11.75
N$8
  Top 0.61: J2.2 61.11,22.55 61.9,23.34 64.76,23.34 65.55,22.55 U3.P5
N$9
  Bottom 0.508: IC4.8 80.16,45.2 80.8,45.84 R12.1 R51.2
N$10
  Bottom 0.508: IC4.7 78.88,45.51 83.18,49.8 R1.1 R52.2
N$11  (via drill 0.65 pad 1.4)
  Top 0.61: C10.1 v73.49,18.1 73.49,15.88 74.44,14.93 U3.3V3
  Bottom 0.61: U1.5 74.63,16.96 v73.49,18.1
N$12  (via drill 0.65 pad 1.4)
  Top 0.508: v63.96,42.87 IC3.8
  Bottom 0.508: IC2.15 61.42,57.47 61.74,57.79 64.28,57.79 64.6,57.47 64.6,47.63 63.96,46.99 v63.96,42.87
N$13
  Bottom 0.813: X2.5 R43.2
N$14
  Bottom 0.813: X2.4 87.14,61.66 86.34,61.66 R44.2
N$15  (via drill 0.65 pad 1.4)
  Top 0.508: IC3.7 v62.69,46.99
  Bottom 0.508: v62.69,46.99 62.69,47.95 62.95,48.2 IC2.1
N$16
  Top 0.508: Q1.2 46.18,66.68 44.76,65.26 R6.2 R7.1
N$17
  Bottom 0.813: X2.3 R47.2
N$18
  Top 0.61: Q5.2 7.13,68.1 R8.1
N$19
  Top 0.61: Q5.4 9.8,67.97 R15.1
N$20
  Top 0.508: R14.1 R10.2 48.57,65.26 49.99,66.68 49.99,69.53 48.85,70.68 Q1.4
N$21  (via drill 0.65 pad 1.4)
  Top 0.508: v61.42,42.87 IC3.6
  Bottom 0.508: IC2.2 v61.42,42.87
N$22
  Top 0.508: Q2.2 54.12,66.68 52.7,65.26 R13.2 R11.1
N$23
  Top 1.016: TR1.C 48.72,7.86 48.89,7.86 48.89,6.99 | 48.89,6.99 | 48.89,6.99 J4.3
N$24
  Bottom 0.813: X2.6 90.3,53.74 R39.2
N$25
  Bottom 0.813: X2.2 R48.2
N$26  (via drill 0.65 pad 1.4)
  Top 0.508: IC3.5 v60.15,46.99
  Bottom 0.508: v60.15,46.99 IC2.3
N$27
  Top 0.61: Q6.2 14.12,68.1 R17.1
N$28
  Bottom 0.813: X2.7 87.14,49.8 86.34,49.8 R1.2
N$29  (via drill 0.65 pad 1.4)
  Top 0.508: v58.88,42.87 IC3.4
  Bottom 0.508: IC2.4 v58.88,42.87
N$30
  Bottom 0.813: X2.1 R49.2
N$31
  Top 0.61: Q6.4 16.78,68.29 R22.1
N$32
  Top 0.508: R21.1 56.02,65.09 | 56.02,65.09 R20.2 | 56.02,65.09 56.34,65.09 57.93,66.68 57.93,69.85 56.86,70.92 Q2.4
N$33
  Top 0.508: Q9.4 31.77,17.34 32.21,17.78 33.48,17.78 | 33.48,17.78 34.12,17.78 34.44,17.46 Q9.2 | R18.2 33.48,17.78
N$34
  Bottom 0.61: C1.1 U1.8
N$35
  Top 0.61: Q7.2 21.42,68.1 R27.1
N$36
  Bottom 0.61: U1.2 77.3,8.89 U$3.D-
N$37  (via drill 0.65 pad 1.4)
  Top 0.508: v57.61,46.99 IC3.3
  Bottom 0.508: IC2.5 v57.61,46.99
N$38  (via drill 0.65 pad 1.4)
  Top 0.508: IC3.2 v56.34,42.87
  Bottom 0.508: v56.34,42.87 IC2.6
N$39  (via drill 0.65 pad 1.4)
  Top 0.508: IC3.1 54.76,44.88 v54.76,46.99
  Bottom 0.508: v54.76,46.99 54.76,47.95 55.07,48.26 IC2.7
N$40
  Top 0.61: Q7.4 24.08,68.29 R32.1
N$41
  Top 0.61: Q8.2 29.67,62.72 R37.1
N$42
  Top 0.508: Q3.2 62.06,66.68 60.47,65.09 60.15,65.09 | 60.15,65.09 R26.1 | R25.2 60.15,65.09
N$44
  Top 0.61: Q8.4 32.34,61.57 29.19,58.42 R42.1
N$45
  Bottom 0.61: U$3.D+ 78.69,7.75 U1.1
N$46
  Bottom 0.813: X2.8 R12.2
N$47  (via drill 0.65 pad 1.4)
  Top 0.508: IC1.9 11,52.81 9.35,54.46 v9.35,55.56
  Bottom 0.508: IC7.14 11.89,58.11 v9.35,55.56
N$48
  Top 0.508: Q10.4 39.32,61.3 R40.1
N$49
  Top 0.508: Q3.4 65.87,69.78 65.87,66.68 64.6,65.41 63.96,65.41 R30.2 R31.1
N$50
  Top 0.508: Q11.4 81.9,69.78 81.9,66.68 80.48,65.26 R33.2 R29.1
N$51
  Top 0.508: Q10.2 36.66,61.11 R50.1
N$52
  Top 0.508: R19.1 R23.2 76.67,65.26 78.09,66.68 Q11.2
N$53  (via drill 0.65 pad 1.4)
  Top 0.508: v71.11,52.55 80,52.55 81.78,54.33 TR4.B
  Bottom 0.508: IC7.7 35.29,53.02 44.81,62.55 65.87,62.55 69.52,58.9 69.52,54.14 v71.11,52.55
N$54  (via drill 0.65 pad 1.4)
  Top 0.508: TR5.B 71.74,55.73 v71.74,55.72
  Bottom 0.508: IC7.6 34.44,54.3 44.28,64.14 66.5,64.14 71.74,58.9 v71.74,55.72
N$55
  Top 0.61: Q11.8 Q11.7
  Top 0.813: Q11.8 76.69,81.27 76.71,81.28 76.58,81.41 X5.3
N$56
  Top 0.508: Q4.2 70.15,66.84 68.57,65.26 R35.2 R36.1
N$57
  Top 0.61: Q11.6 80.58,76.41 80.67,76.49
  Top 0.813: Q11.5 80.67,76.49 80.67,81.28 80.54,81.41 X5.4
N$58
  Top 0.61: Q10.8 Q10.7
  Top 0.813: X4.3 36.26,73.98 35.26,72.98 Q10.8
N$59
  Top 0.61: Q10.6 Q10.5
  Top 0.813: X4.4 40.22,73.98 39.32,73.09 Q10.5
N$60
  Top 1.016: Q9.6 Q9.7 Q9.8 | Q9.6 Q9.5 | Q9.6 32.69,10.12 J7.2
N$61
  Top 1.016: D3.C 30.77,35.24 34.23,31.78 MODUL1.IN+
N$62
  Top 1.016: D3.A D4.C
N$63
  Top 0.508: Q4.4 73.96,69.78 73.96,66.68 72.54,65.26 R38.2 R41.1
N$64
  Top 0.508: X7.1 80.16,36.52 78.25,34.61 U3.P12
N$65
  Top 0.508: U3.P13 80.79,32.7 82.06,33.98 X7.2
N$66
  Top 0.508: X7.3 84.6,31.44 U3.P14
N$67
  Top 0.508: X7.4 84.6,28.89 U3.P15
N$68
  Top 0.813: IC6.2 9.78,26.56 10.37,25.97 17.29,25.97 | 18.89,26.04 18.82,25.97 17.29,25.97 | D5.C 17.29,18.9 17.29,25.97
  Top 1.016: 21.33,24.45 21.28,24.43
  pour Top (isolate 0.61): 15.7,31.44 21.73,31.44 21.73,20.64 15.7,20.64
N$69
  Top 0.508: U3.P26 84.44,25.09 85.71,23.82 X8.1
N$70
  Top 0.508: U3.P27 84.44,22.55 85.71,21.27 X8.2
N$71
  Top 0.61: IC6.4 6.38,31.44 R2.2 4.42,31.44 R5.1
N$72
  Top 0.508: U3.P28 84.44,20 85.71,18.73 X8.3
N$73
  Top 0.61: R28.1 56.5,14.77 54.42,16.85 TR2.B
N$74
  Top 0.508: TR3.B 49.37,22.24 48.41,21.27 R45.1
N$75
  Top 0.508: U3.P29 84.28,17.46 85.55,16.2 X8.4
N$84  (via drill 0.65 pad 1.4)
  Top 0.61: IC1.14 v17.61,48.9
  Bottom 0.508: v17.61,48.9 19.83,48.9 24.27,44.45 39.52,44.45 50.95,55.88 53.45,55.88 IC2.9 53.48,55.84
N$86  (via drill 0.65 pad 1.4)
  Top 0.61: R45.2 v43.01,19.53
  Bottom 0.61: J4.2 52.85,9.69 v43.01,19.53
P2
  Top 0.61: U3.P2 62.21,14.93 59.2,11.92 R28.2
P3
  Top 0.61: TR3.E 53.04,21.87 54.27,20.64 R46.2 56.34,17.46 U3.P3
P6
  Top 0.508: U3.P6 56.49,25.09 55.39,26.19 47.93,26.19 47.13,25.4 R9.2 44.27,25.4 39.52,20.65 39.52,9.2 41.9,6.83 J6.2
P7
  Top 0.508: U3.P7 65.55,27.62 65.23,27.31 39.36,27.31 R18.1
SH_CP  (via drill 0.65 pad 1.4)
  Top 0.508: U3.P10 73.17,43.82 66.5,50.48 48.09,50.48 v45.55,53.02
  Top 0.61: IC1.11 13.8,47.63 16.34,45.09 26.82,45.09 v29.36,47.63
  Bottom 0.508: IC2.11 56.34,58.11 56.02,58.42 50.95,58.42 v45.55,53.02 40.15,47.63 v29.36,47.63 26.5,47.63 25.86,48.26 25.86,53.98 25.55,54.3 IC7.11
ST_CP  (via drill 0.65 pad 1.4)
  Top 0.508: v27.45,49.22 v38.56,49.22 65.87,49.22 70.63,44.46 U3.P9
  Top 0.61: v27.45,49.22 24.91,46.67 16.66,46.67 15.07,48.26 IC1.12
  Bottom 0.508: IC2.12 57.61,58.74 56.66,59.69 49.04,59.69 v38.56,49.22 | IC7.12 26.06,55.56 27.13,54.49 27.13,49.53 v27.45,49.22
VCC  (via drill 0.65 pad 1.52)
  Top 0.508: R16.1 45.57,12.26 TR1.E
  Top 1.016: TR1.E 45.55,12.28 43.68,12.27 v43.66,12.26
  Bottom 1.016: R24.1 v43.66,12.26

### Text on the board
tValues: C1 C2 C3 C4 C5 C6 | L1 L2 L3 L4 L5 L6 L7 L8 L9 L10 | BLACK CABLE | RED CABLE | OFFSET MOTOR / POSITION | C7 C8 C9 C10 | YELLOW CABLE | H8 H7 H6 H5 H4 H3 H2 H1 | MCU-VM 5.2 / timtektgm2025 | OFFSET / INTERRUPT | 74hc595 | H1...H8 | ST_CP | SH_CP | DS | LOCK | SUHU | UART1 | G | RX | TX | IR_interrupt | IR_trigger | V1 SIG GND | 24V_GND | UART0 | V DI G | G DI V | G | RX | TX